# EAGLE design PCB Class (EAGLE 8.7.1)
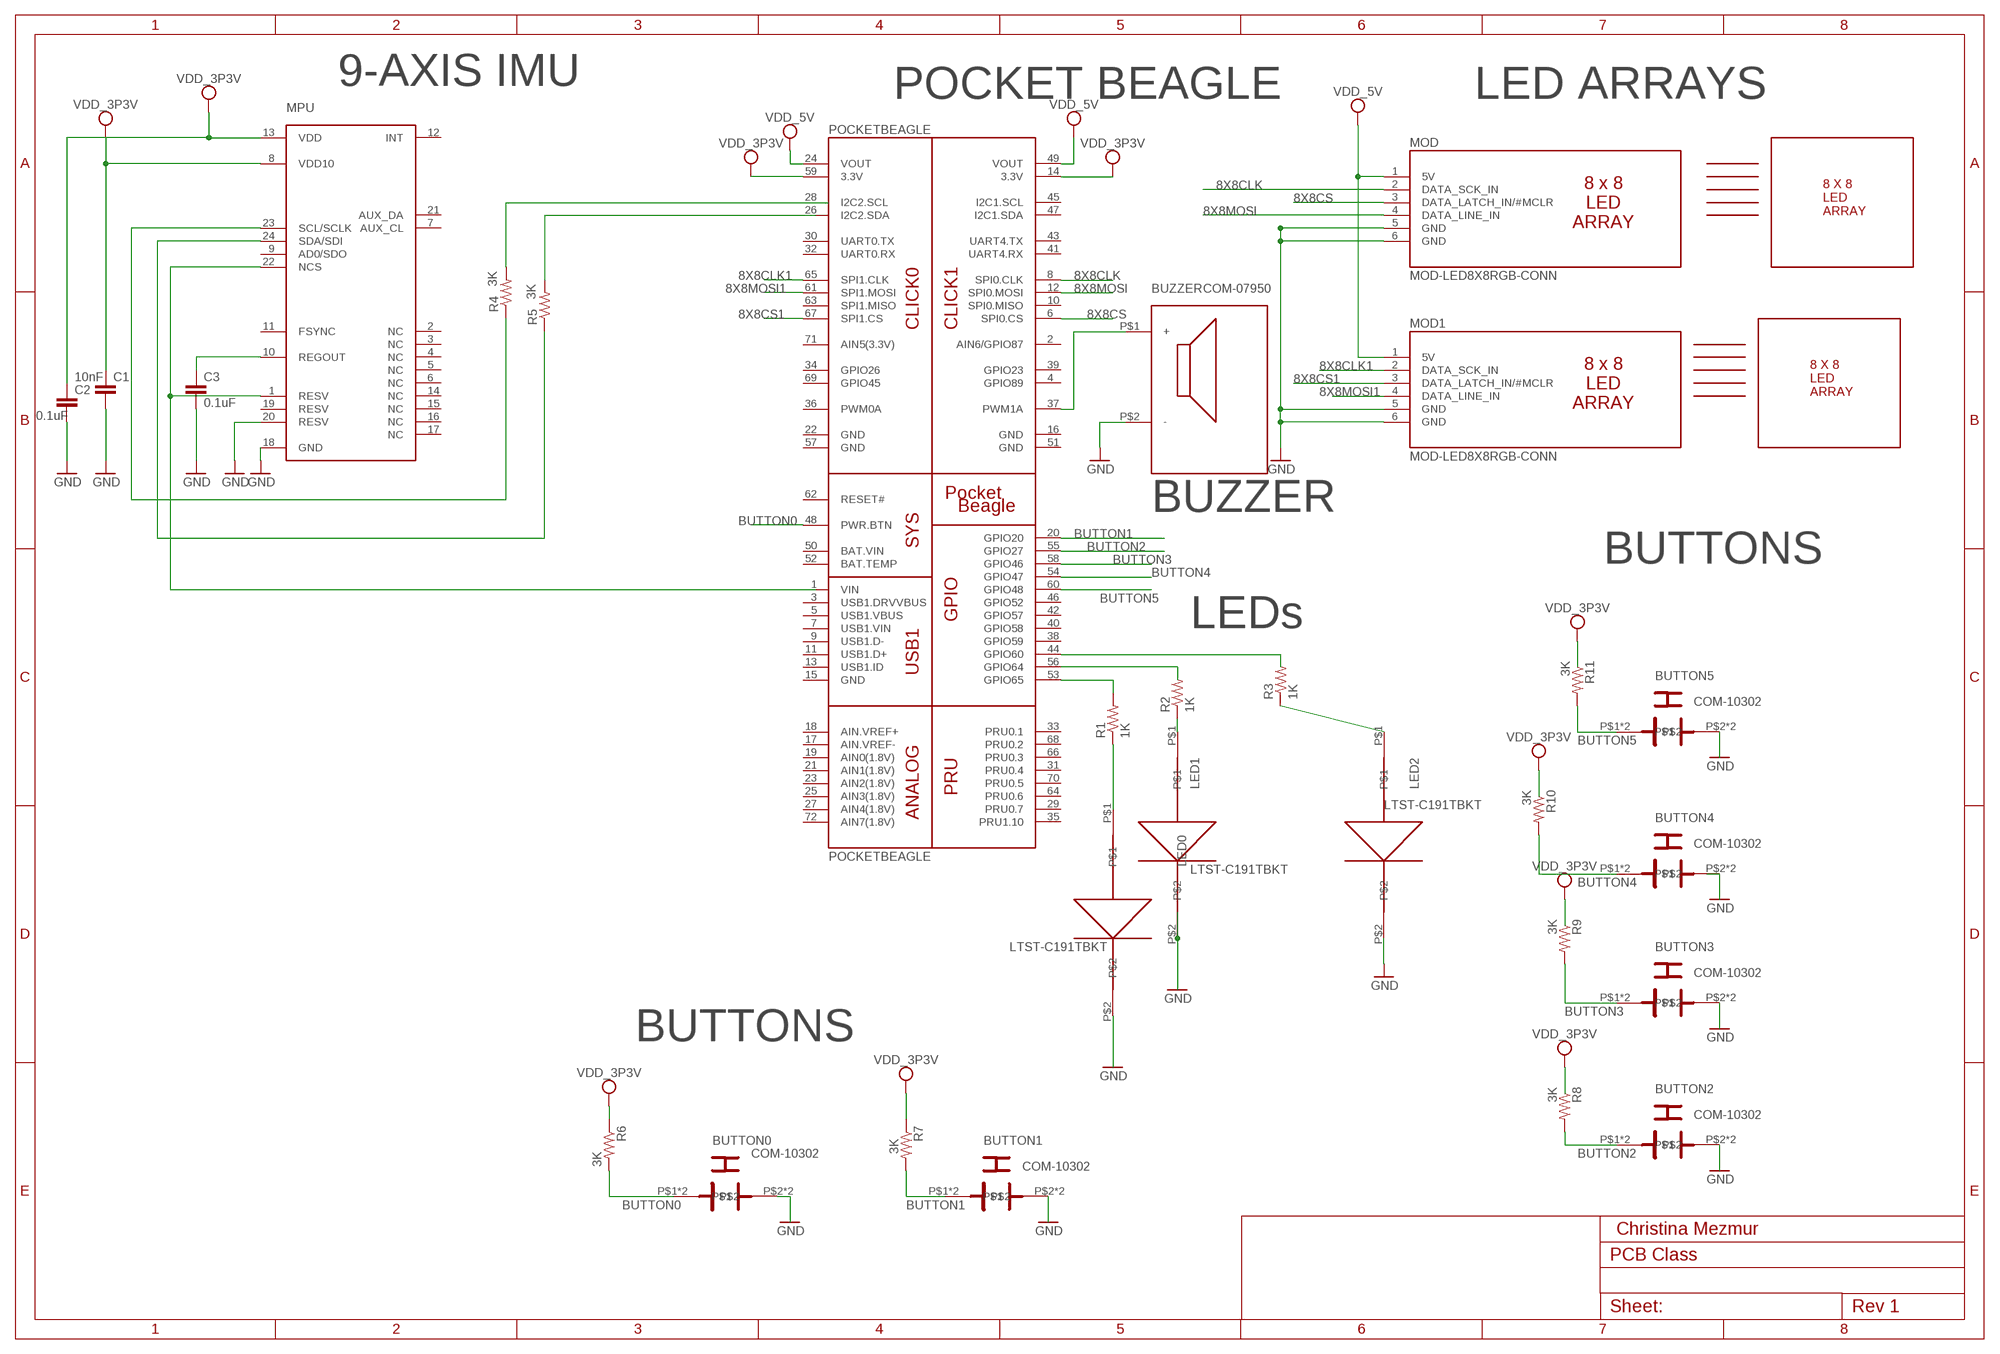
[diagram p0: schematic, sheet 1]

## Parts
BUTTON0  BUTTON  [BUTTON]
BUTTON1  BUTTON  [BUTTON]
BUTTON2  BUTTON  [BUTTON]
BUTTON3  BUTTON  [BUTTON]
BUTTON4  BUTTON  [BUTTON]
BUTTON5  BUTTON  [BUTTON]
BUZZER  SEM-1203(42)  [SEM-1203(42)]
C1  10nF  C_C0402  [C0402]
C2  0.1uF  C_C0402  [C0402]
C3  0.1uF  C_C0402  [C0402]
LED0  LTST-C191TBKT  [LTST-C191TBKT]
LED1  LTST-C191TBKT  [LTST-C191TBKT]
LED2  LTST-C191TBKT  [LTST-C191TBKT]
MOD  MOD-LED8X8RGB-CONN  [FE06W]
MOD1  MOD-LED8X8RGB-CONN  [FE06W]
MPU  MPU-9250  [QFN-3MMX3MM]
POCKETBEAGLE  POCKETBEAGLE  [POCKETBEAGLE]
R1  1K  R_R0603  [R0603]
R2  1K  R_R0603  [R0603]
R3  1K  R_R0603  [R0603]
R4  3K  R_R0603  [R0603]
R5  3K  R_R0603  [R0603]
R6  3K  R_R0603  [R0603]
R7  3K  R_R0603  [R0603]
R8  3K  R_R0603  [R0603]
R9  3K  R_R0603  [R0603]
R10  3K  R_R0603  [R0603]
R11  3K  R_R0603  [R0603]

## Nets
8X8CLK: MOD.2(DATA_SCK_IN) POCKETBEAGLE.8(SPI0.CLK)
8X8CLK1: MOD1.2(DATA_SCK_IN) POCKETBEAGLE.65(SPI1.CLK)
8X8CS: MOD.3(DATA_LATCH_IN/#MCLR) POCKETBEAGLE.6(SPI0.CS)
8X8CS1: MOD1.3(DATA_LATCH_IN/#MCLR) POCKETBEAGLE.67(SPI1.CS)
8X8MOSI: MOD.4(DATA_LINE_IN) POCKETBEAGLE.12(SPI0.MOSI)
8X8MOSI1: MOD1.4(DATA_LINE_IN) POCKETBEAGLE.61(SPI1.MOSI)
BUTTON0: BUTTON0.P$1 BUTTON0.P$3 POCKETBEAGLE.48(PWR.BTN) R6.2
BUTTON1: BUTTON1.P$1 BUTTON1.P$3 POCKETBEAGLE.20(GPIO20) R7.2
BUTTON2: BUTTON2.P$1 BUTTON2.P$3 POCKETBEAGLE.55(GPIO27) R8.2
BUTTON3: BUTTON3.P$1 BUTTON3.P$3 POCKETBEAGLE.58(GPIO46) R9.2
BUTTON4: BUTTON4.P$1 BUTTON4.P$3 POCKETBEAGLE.54(GPIO47) R10.2
BUTTON5: BUTTON5.P$1 BUTTON5.P$3 POCKETBEAGLE.60(GPIO48) R11.2
GND: BUZZER.P$2(-) C1.2 C2.2 C3.2 MOD1.5(GND) MOD1.6(GND) MOD.5(GND) MOD.6(GND) MPU.18(GND) MPU.20(RESV)
N$1: C3.1 MPU.10(REGOUT)
N$2: MPU.24(SDA/SDI) R5.1
N$3: MPU.23(SCL/SCLK) R4.1
N$5: POCKETBEAGLE.56(GPIO64) R2.2
N$6: POCKETBEAGLE.44(GPIO60) R3.2
N$7: MPU.1(RESV) MPU.22(NCS)
N$8: LED0.P$2
N$9: LED1.P$2
N$10: LED2.P$2 ; supply symbol labelled GND
N$11: LED2.P$1 R3.1
N$12: LED0.P$1 R1.1
N$13: LED1.P$1 R2.1
N$14: POCKETBEAGLE.53(GPIO65) R1.2
N$15: BUZZER.P$1(+) POCKETBEAGLE.37(PWM1A)
N$16: BUTTON0.P$2 BUTTON0.P$4
N$17: R4.2
N$18: R5.2
N$19: BUTTON1.P$2 BUTTON1.P$4
N$20: BUTTON5.P$2 BUTTON5.P$4
N$22: BUTTON3.P$2 BUTTON3.P$4
N$23: BUTTON2.P$2 BUTTON2.P$4
N$25: POCKETBEAGLE.24(VOUT) ; supply symbol labelled VDD_5V
SYS_VDD1_3P3V: C1.1 C2.1 MOD1.1(5V) MOD.1(5V) MPU.8(VDD10) MPU.13(VDD) POCKETBEAGLE.14(3.3V) POCKETBEAGLE.49(VOUT) POCKETBEAGLE.59(3.3V) R6.1 R7.1 ; supply symbol labelled VDD_3P3V, VDD_5V
Unconnected: BUTTON4.P$2 BUTTON4.P$4 MPU.2(NC) MPU.3(NC) MPU.4(NC) MPU.5(NC) MPU.6(NC) MPU.7(AUX_CL) MPU.9(AD0/SDO) MPU.11(FSYNC) MPU.12(INT) MPU.14(NC) MPU.15(NC) MPU.16(NC) MPU.17(NC) MPU.19(RESV) MPU.21(AUX_DA) POCKETBEAGLE.1(VIN) POCKETBEAGLE.2(AIN6/GPIO87) POCKETBEAGLE.3(USB1.DRVVBUS) POCKETBEAGLE.4(GPIO89) POCKETBEAGLE.5(USB1.VBUS) POCKETBEAGLE.7(USB1.VIN) POCKETBEAGLE.9(USB1.D-) POCKETBEAGLE.10(SPI0.MISO) POCKETBEAGLE.11(USB1.D+) POCKETBEAGLE.13(USB1.ID) POCKETBEAGLE.15(GND) POCKETBEAGLE.16(GND) POCKETBEAGLE.17(AIN.VREF-) POCKETBEAGLE.18(AIN.VREF+) POCKETBEAGLE.19(AIN0(1.8V)) POCKETBEAGLE.21(AIN1(1.8V)) POCKETBEAGLE.22(GND) POCKETBEAGLE.23(AIN2(1.8V)) POCKETBEAGLE.25(AIN3(1.8V)) POCKETBEAGLE.26(I2C2.SDA) POCKETBEAGLE.27(AIN4(1.8V)) POCKETBEAGLE.28(I2C2.SCL) POCKETBEAGLE.29(PRU0.7) POCKETBEAGLE.30(UART0.TX) POCKETBEAGLE.31(PRU0.4) POCKETBEAGLE.32(UART0.RX) POCKETBEAGLE.33(PRU0.1) POCKETBEAGLE.34(GPIO26) POCKETBEAGLE.35(PRU1.10) POCKETBEAGLE.36(PWM0A) POCKETBEAGLE.38(GPIO59) POCKETBEAGLE.39(GPIO23) POCKETBEAGLE.40(GPIO58) POCKETBEAGLE.41(UART4.RX) POCKETBEAGLE.42(GPIO57) POCKETBEAGLE.43(UART4.TX) POCKETBEAGLE.45(I2C1.SCL) POCKETBEAGLE.46(GPIO52) POCKETBEAGLE.47(I2C1.SDA) POCKETBEAGLE.50(BAT.VIN) POCKETBEAGLE.51(GND) POCKETBEAGLE.52(BAT.TEMP) POCKETBEAGLE.57(GND) POCKETBEAGLE.62(RESET#) POCKETBEAGLE.63(SPI1.MISO) POCKETBEAGLE.64(PRU0.6) POCKETBEAGLE.66(PRU0.3) POCKETBEAGLE.68(PRU0.2) POCKETBEAGLE.69(GPIO45) POCKETBEAGLE.70(PRU0.5) POCKETBEAGLE.71(AIN5(3.3V)) POCKETBEAGLE.72(AIN7(1.8V)) R8.1 R9.1 R10.1 R11.1

## Notes on the sheet
- 9-AXIS IMU | POCKET BEAGLE | LED ARRAYS
- 8 X 8
  LED
  ARRAY
- COM-07950
- 8 X 8
  LED
  ARRAY
- BUZZER
- BUTTONS
- LEDs
- COM-10302
- LTST-C191TBKT
- COM-10302
- LTST-C191TBKT
- LTST-C191TBKT
- COM-10302
- BUTTONS
- COM-10302
- COM-10302
- COM-10302
- Christina Mezmur

## Library data of the parts
BUTTON0 BUTTON1-BUTTON5 = ENGI301_PCB_design_project:BUTTON
BUZZER = ENGI301_PCB_design_project:SEM-1203(42)
C1-C3 = ENGI301_PCB_design_project:C_: Capacitor SMD. Sizes: 0402, 0603 & 0805
LED0 LED1 LED2 = ENGI301_PCB_design_project:LTST-C191TBKT
MOD MOD1 = ENGI301_PCB_design_project:MOD-LED8X8RGB-CONN
MPU = ENGI301_PCB_design_project:MPU-9250
POCKETBEAGLE = ENGI301_PCB_design_project:POCKETBEAGLE
R1-R11 = ENGI301_PCB_design_project:R_: RESISTOR, American symbol

## Board
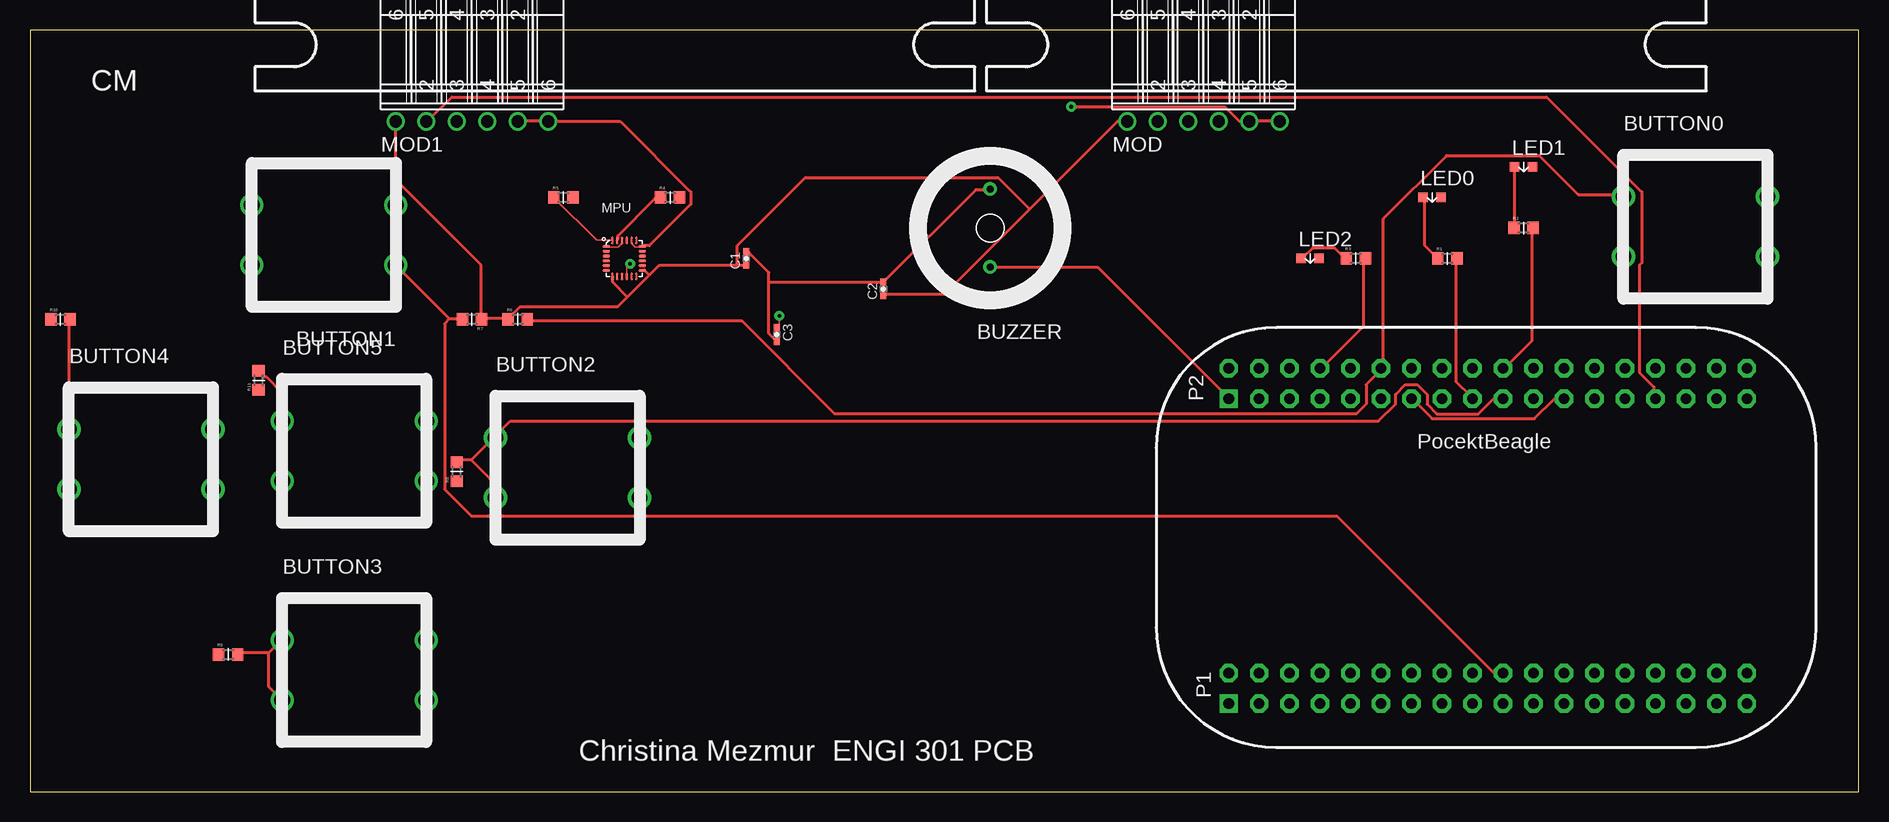
[diagram p1: board, top side]
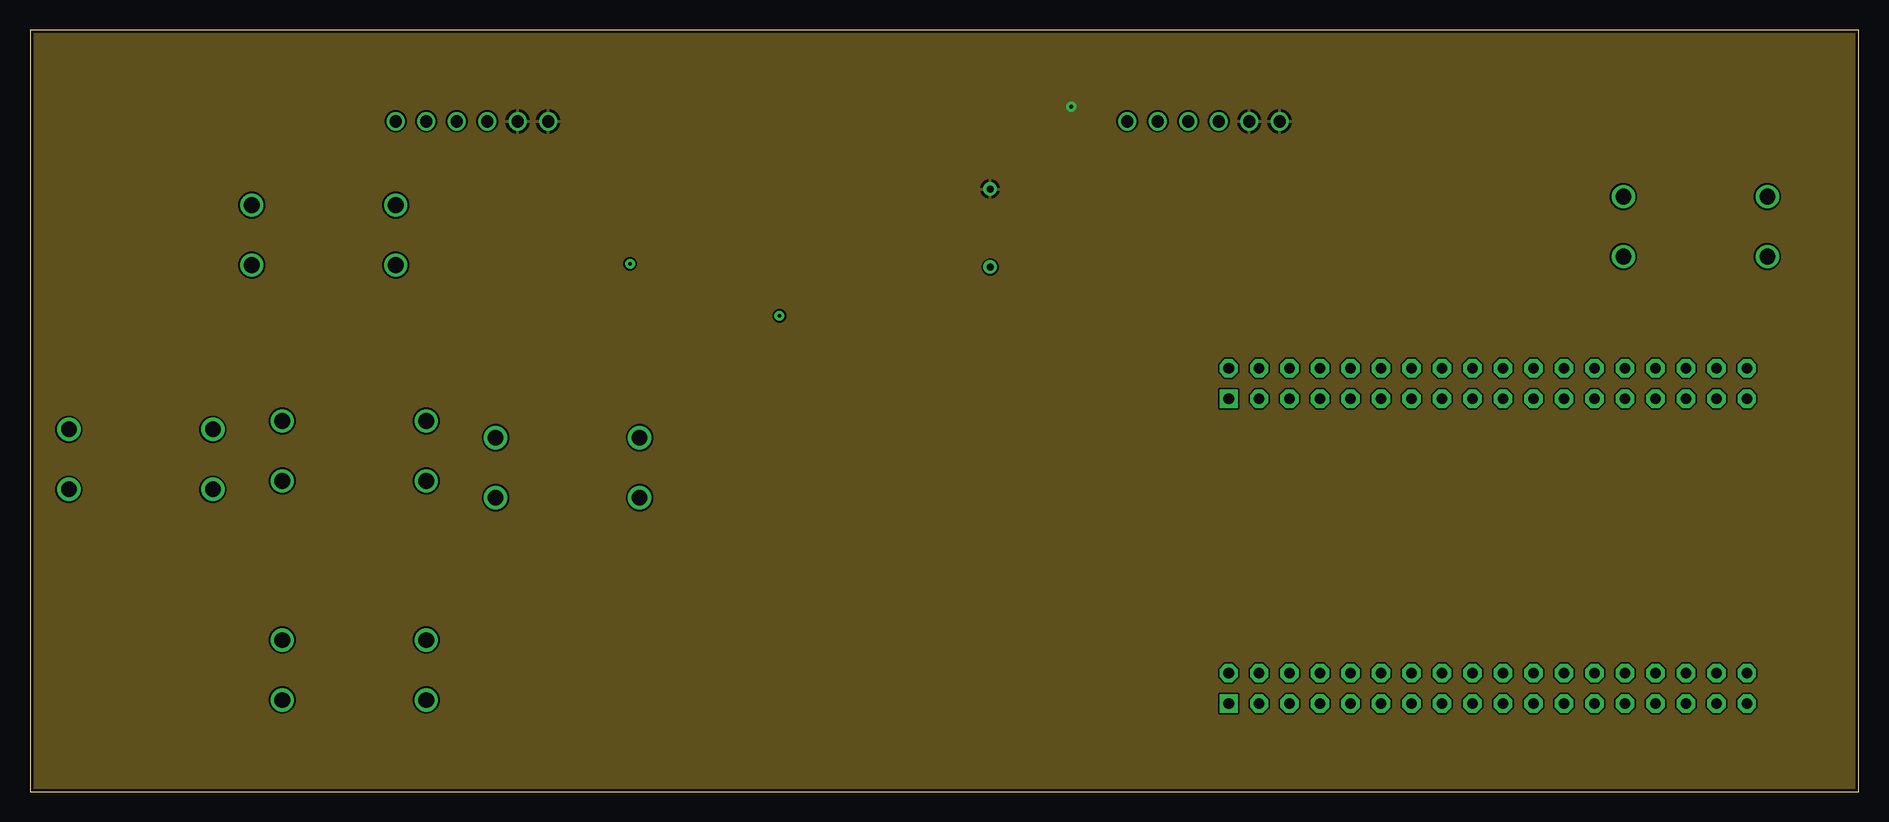
[diagram p2: board, inner layer Route2]
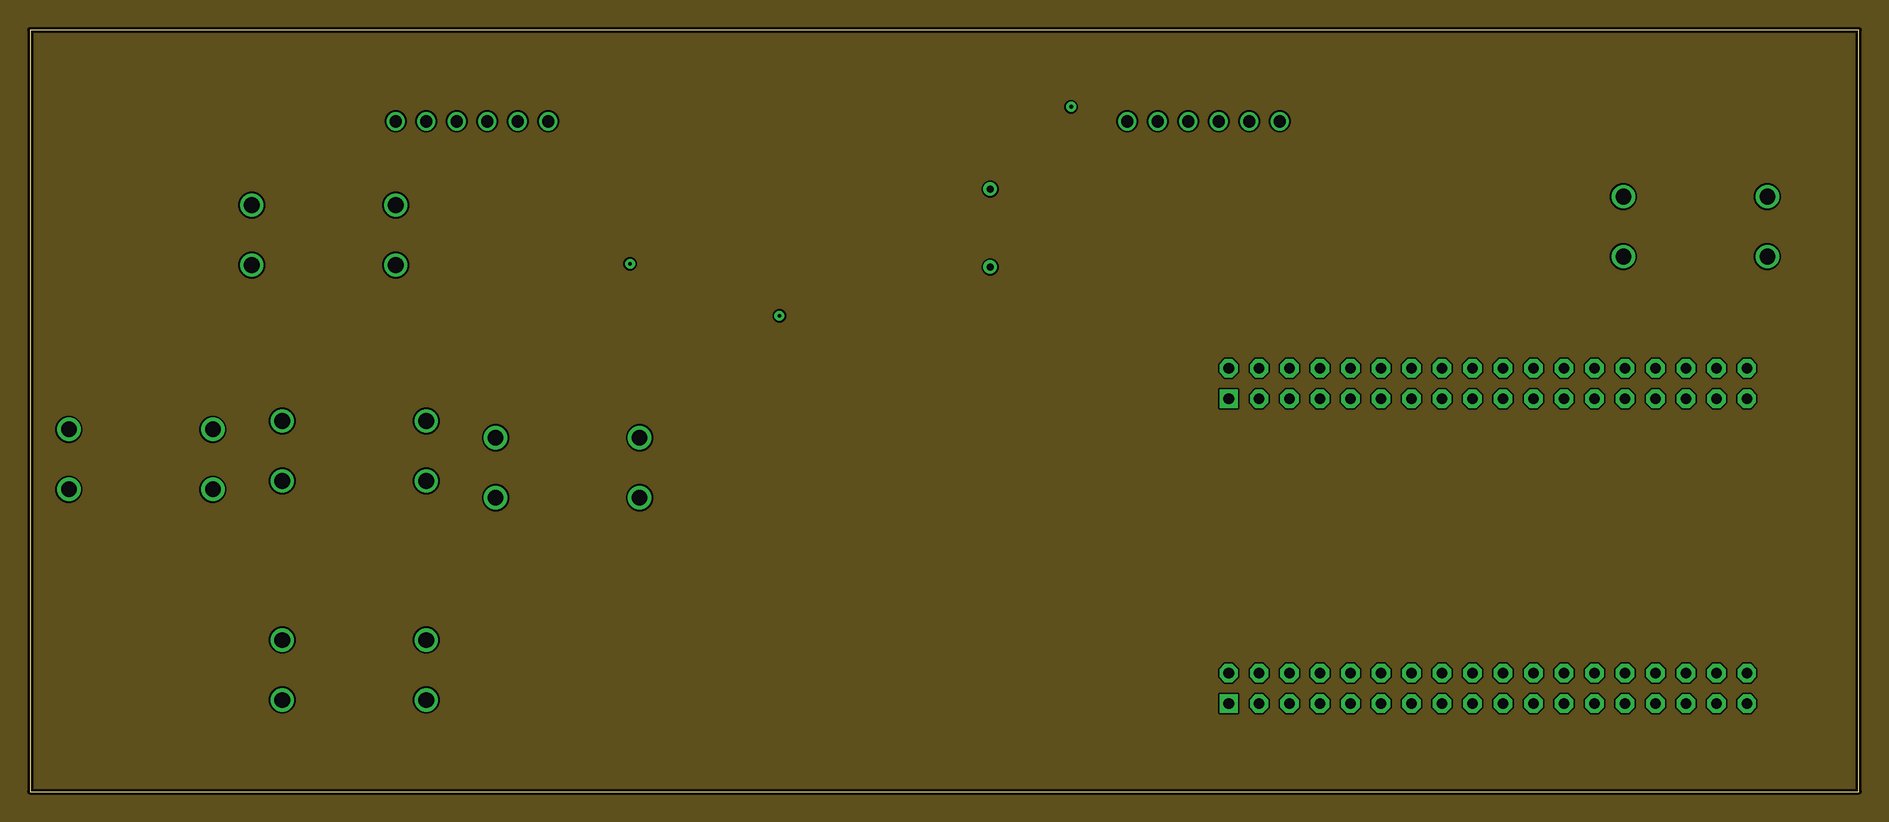
[diagram p3: board, inner layer Route15]
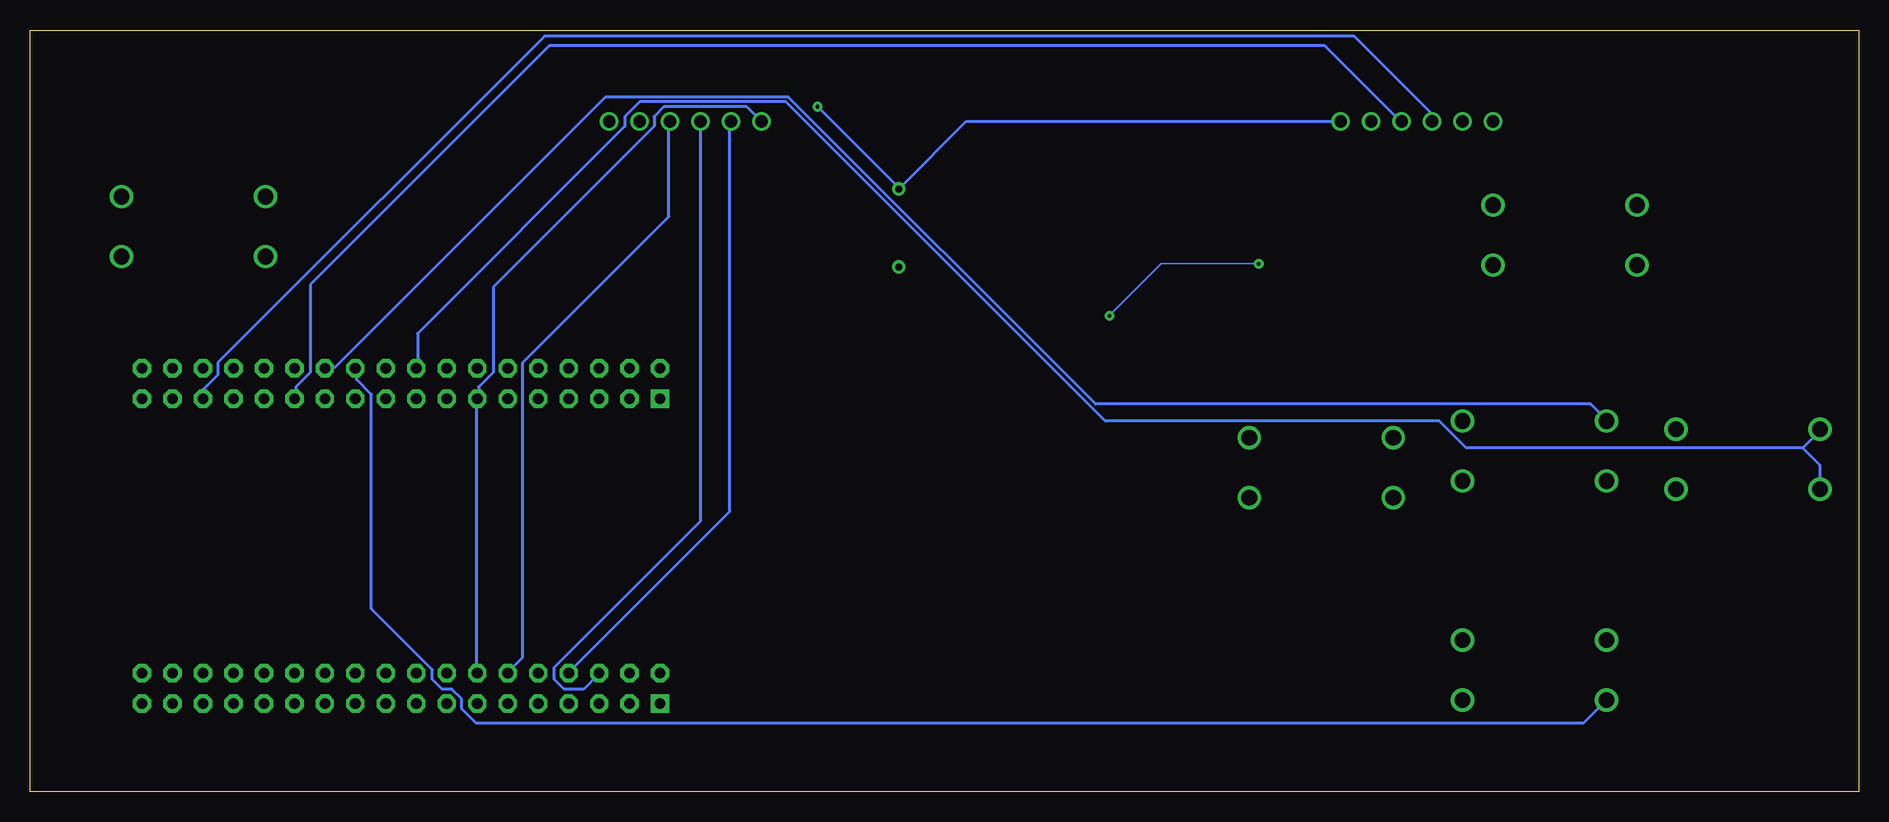
[diagram p4: board, bottom side, seen from below]

Size 152.4 x 63.5 mm. Coordinates in mm from the lower left corner, seen from the top.
Outline: 0,0 152.4,0 152.4,63.5 0,63.5 0,0
Copper layers (1*2*15*16): Top 0.035mm / dielectric 0.23mm / Route2 0.035mm / dielectric 0.93mm / Route15 0.035mm / dielectric 0.23mm / Bottom 0.035mm
Design rules "ENGI301_Maze_Project_4lyr (1) *": minimum track width 5mil, minimum drill 12mil, track to track 6mil, track to pad 5mil, pad to pad 5mil, via to via 10mil, smd to smd 10mil, copper to edge 10mil, drill to drill 12mil, minimum pad ring 10mil, minimum via ring 10mil, stop-mask expansion 3mil, vias tented up to drill 25mil, thermal gap 10mil

### Footprints (pad centres in the part's own frame; a part is rotated, then mirrored left to right if it is on the bottom)
BUTTON = drill 1.3: P$1 -6,2.5; P$2 6,2.5; P$3 -6,-2.5; P$4 6,-2.5
SEM-1203(42) = drill 0.6: P$1 0,3.25; P$2 0,-3.25
C0402 = smd 0.61 x 0.508: 1 -0.559,0; 2 0.559,0
LTST-C191TBKT = smd 0.8 x 0.8: P$1 -0.75,0; P$2 0.75,0
FE06W = drill 1.016: 1 -6.35,0; 2 -3.81,0; 3 -1.27,0; 4 1.27,0; 5 3.81,0; 6 6.35,0
QFN-3MMX3MM = smd 0.6 x 0.2: 1 -1.5,1; 2 -1.5,0.6; 3 -1.5,0.2; 4 -1.5,-0.2; 5 -1.5,-0.6; 6 -1.5,-1; 13 1.5,-1; 14 1.5,-0.6; 15 1.5,-0.2; 16 1.5,0.2; 17 1.5,0.6; 18 1.5,1 | smd 0.2 x 0.6: 7 -0.6,-1.5; 8 -1,-1.5; 9 -0.2,-1.5; 10 0.2,-1.5; 11 0.6,-1.5; 12 1,-1.5; 19 1,1.5; 20 0.6,1.5; 21 0.2,1.5; 22 -0.2,1.5; 23 -0.6,1.5; 24 -1,1.5
POCKETBEAGLE = drill 0.889 pad 1.524 square: 1 5.91,3.53; 37 5.91,28.93 | drill 0.889 pad 1.524 octagon: 2 5.91,6.07; 3 8.45,3.53; 4 8.45,6.07; 5 10.99,3.53; 6 10.99,6.07; 7 13.53,3.53; 8 13.53,6.07; 9 16.07,3.53; 10 16.07,6.07; 11 18.61,3.53; 12 18.61,6.07; 13 21.15,3.53; 14 21.15,6.07; 15 23.69,3.53; 16 23.69,6.07; 17 26.23,3.53; 18 26.23,6.07; 19 28.77,3.53; 20 28.77,6.07; 21 31.31,3.53; 22 31.31,6.07; 23 33.85,3.53; 24 33.85,6.07; 25 36.39,3.53; 26 36.39,6.07; 27 38.93,3.53; 28 38.93,6.07; 29 41.47,3.53; 30 41.47,6.07; 31 44.01,3.53; 32 44.01,6.07; 33 46.55,3.53; 34 46.55,6.07; 35 49.09,3.53; 36 49.09,6.07; 38 5.91,31.47; 39 8.45,28.93; 40 8.45,31.47; 41 10.99,28.93; 42 10.99,31.47; 43 13.53,28.93; 44 13.53,31.47; 45 16.07,28.93; 46 16.07,31.47; 47 18.61,28.93; 48 18.61,31.47; 49 21.15,28.93; 50 21.15,31.47; 51 23.69,28.93; 52 23.69,31.47; 53 26.23,28.93; 54 26.23,31.47; 55 28.77,28.93; 56 28.77,31.47; 57 31.31,28.93; 58 31.31,31.47; 59 33.85,28.93; 60 33.85,31.47; 61 36.39,28.93; 62 36.39,31.47; 63 38.93,28.93; 64 38.93,31.47; 65 41.47,28.93; 66 41.47,31.47; 67 44.01,28.93; 68 44.01,31.47; 69 46.55,28.93; 70 46.55,31.47; 71 49.09,28.93; 72 49.09,31.47
R0603 = smd 0.95 x 1.031: 1 -0.8,0; 2 0.8,0

### Placement (x,y rotation side)
BUTTON0  138.78,47.1 0 top
BUTTON1  24.48,46.4 180 top
BUTTON2  44.8,27 0 top
BUTTON3  27.02,10.14 0 top
BUTTON4  9.24,27.7 0 top
BUTTON5  27.02,28.4 0 top
BUZZER  80.01,46.99 180 top
C1  59.69,44.45 90 top
C2  71.12,41.91 90 top
C3  62.23,38.1 270 top
LED0  116.84,49.53 0 top
LED1  124.46,52.07 0 top
LED2  106.68,44.45 0 top
MOD  97.79,55.88 0 top
MOD1  36.83,55.88 0 top
MPU  49.53,44.45 0 top
POCKETBEAGLE  93.98,3.81 0 top
R1  118.11,44.45 0 top
R2  124.46,46.99 0 top
R3  110.49,44.45 0 top
R4  53.34,49.53 0 top
R5  44.45,49.53 0 top
R6  40.64,39.37 0 top
R7  36.83,39.37 180 top
R8  35.56,26.67 90 top
R9  16.51,11.43 0 top
R10  2.54,39.37 0 top
R11  19.05,34.29 90 top
U$1  [MOD-LED8X8RGB]  78.74,58.42 90 top
U$2  [MOD-LED8X8RGB]  139.7,58.42 90 top
U$3  [MOD-LED8X8RGB]  78.74,116.84 90 top  (outside the outline)
U$4  [MOD-LED8X8RGB]  139.7,116.84 90 top  (outside the outline)

### Tracks (layer width: path | path; a pad name or v marks a point on that pad's centre or on a via)
8X8CLK
  Bottom 0.254: MOD.2 94.08,55.88 94.08,23.37 107.49,9.96 POCKETBEAGLE.8
8X8CLK1
  Top 0.254: POCKETBEAGLE.65 135.33,32.92 135.33,33.73 134.11,34.95 134.11,43.89 134.31,44.09 134.31,49.99 126.39,57.91 35.15,57.91 33.12,55.88 MOD1.2
8X8CS
  Bottom 0.254: MOD.3 96.52,22.55 108.71,10.36 108.71,9.35 107.9,8.53 106.27,8.53 105.05,9.75 POCKETBEAGLE.6
8X8CS1
  Bottom 0.254: MOD1.3 35.56,56.49 42.06,62.99 109.53,62.99 136.75,35.76 136.75,34.75 137.97,33.53 137.97,32.92 POCKETBEAGLE.67
8X8MOSI
  Bottom 0.254: MOD.4 99.16,55.88 99.16,47.95 111.35,35.76 111.35,11.18 112.57,9.96 POCKETBEAGLE.12
8X8MOSI1
  Bottom 0.254: POCKETBEAGLE.61 130.25,32.92 130.25,33.73 129.03,34.95 129.03,42.27 109.12,62.18 44.5,62.18 38.2,55.88 MOD1.4
BUTTON0
  Top 0.254: BUTTON0.P$3 132.89,44.7 132.89,49.58 BUTTON0.P$1 132.69,49.78 129.03,49.78 125.78,53.03 118.06,53.03 112.78,47.75 112.78,35.36 POCKETBEAGLE.48 112.57,35.15 111.35,33.93 111.35,32.31 110.54,31.5 67.06,31.5 59.33,39.22 41.45,39.22 R6.2
BUTTON1
  Top 0.254: 34.95,39.42 35.97,39.42 R7.2 | 34.95,39.42 BUTTON1.P$1 BUTTON1.P$3 | 34.95,39.42 34.54,39.01 34.54,25.2 36.78,22.96 108.92,22.96 121.92,9.96 122.73,9.96 POCKETBEAGLE.20
BUTTON2
  Top 0.254: 36.78,27.64 35.56,27.64 R8.2 | 36.78,27.64 38.61,29.46 BUTTON2.P$1 38.81,29.67 40.03,30.89 112.37,30.89 113.79,32.31 113.79,33.12 114.61,33.93 115.62,33.93 116.43,33.12 116.43,32.31 117.25,31.5 120.7,31.5 121.92,32.72 122.73,32.72 POCKETBEAGLE.55 | 36.78,27.64 38.61,25.81 38.61,24.59 BUTTON2.P$3
BUTTON3
  Top 0.254: 19.91,11.58 17.48,11.58 R9.2 | 19.91,11.58 20.93,12.6 BUTTON3.P$1 | 19.91,11.58 19.91,8.74 20.93,7.72 BUTTON3.P$3
  Bottom 0.254: POCKETBEAGLE.58 125.17,35.15 125.17,34.34 123.95,33.12 123.95,15.24 118.87,10.16 118.87,9.35 118.06,8.53 117.25,8.53 116.43,7.72 116.43,6.91 115.21,5.69 22.96,5.69 21.13,7.52 BUTTON3.P$3
BUTTON4
  Top 0.254: R10.2 3.25,39.22 3.25,30.28 BUTTON4.P$1
  Bottom 0.254: 4.67,28.65 32.72,28.65 34.95,30.89 62.79,30.89 89.41,57.51 101.6,57.51 102.82,56.29 102.82,55.47 120.09,38.2 120.09,35.36 POCKETBEAGLE.54 | 4.67,28.65 3.25,30.07 BUTTON4.P$1 | 4.67,28.65 3.25,27.23 3.25,25.4 BUTTON4.P$3
BUTTON5
  Top 0.254: R11.2 19.1,34.95 19.51,34.54 19.71,34.54 20.93,33.33 20.93,31.09 BUTTON5.P$1 21.13,30.89 21.13,26.01 BUTTON5.P$3
  Bottom 0.254: POCKETBEAGLE.60 127.81,35.36 127,35.36 104.44,57.91 89.2,57.91 63.6,32.31 22.35,32.31 21.13,31.09 BUTTON5.P$1
GND  (via drill 0.3)
  Top 0.127: MPU.20 50.15,45.82 50.15,45.68 50.43,45.4 50.99,45.4 MPU.18
  Top 0.254: MOD.6 MOD.5 100.79,55.88 99.57,57.1 v86.77,57.1 | MOD1.5 MOD1.6 49.17,55.88 55.07,49.99 55.07,48.97 51.61,45.52 51.21,45.52 MPU.18 | 61.57,42.47 61.57,38.2 C3.2 | 61.57,42.47 61.57,43.28 59.94,44.91 59.74,44.91 C1.2 | 61.57,42.47 C2.2 78.84,50.19 79.86,50.19 BUZZER.P$2
  Bottom 0.254: MOD1.6 74.37,55.88 79.86,50.39 BUZZER.P$2 80.06,50.39 v86.77,57.1
  pour Route2: -12.7,-12.7 -12.7,76.2 165.1,76.2 165.1,-12.7
N$1  (via drill 0.3)
  Top 0.127: v50.01,44.01 49.73,43.73 49.73,43.03 MPU.10 | v62.45,39.67 62.45,38.84 62.31,38.7 C3.1
  Bottom 0.127: v50.01,44.01 58.12,44.01 v62.45,39.67
N$2
  Top 0.127: R5.1 47.22,45.96 48.48,45.96 MPU.24
N$3
  Top 0.254: MPU.23 48.97,46.13 48.97,46.33 52.02,49.38 52.43,49.38 R4.1
N$5
  Top 0.254: R2.2 125.17,46.94 125.17,37.59 122.94,35.36 POCKETBEAGLE.56
N$6
  Top 0.254: R3.2 111.15,44.3 111.15,38.81 107.7,35.36 POCKETBEAGLE.44
N$7
  Top 0.127: MPU.1 48.06,45.4 49.03,45.4 49.31,45.68 49.31,45.82 MPU.22
N$11
  Top 0.254: LED2.P$1 106.07,44.5 106.88,45.31 108.71,45.31 109.53,44.5 R3.1
N$12
  Top 0.254: LED0.P$1 116.23,49.38 116.23,45.52 117.25,44.5 R1.1
N$13
  Top 0.254: LED1.P$1 123.75,52.02 123.75,47.14 R2.1
N$14
  Top 0.254: R1.2 118.87,44.3 118.87,34.14 120.09,32.92 POCKETBEAGLE.53
N$15
  Top 0.254: BUZZER.P$1 80.06,43.69 89,43.69 99.77,32.92 POCKETBEAGLE.37
N$16
  Top 0.254: BUTTON0.P$4 144.88,44.7 144.88,49.58 BUTTON0.P$2
N$19
  Top 0.254: BUTTON1.P$2 18.49,44.09 18.49,48.77 BUTTON1.P$4
N$20
  Top 0.254: BUTTON5.P$4 33.12,26.01 33.12,30.89 BUTTON5.P$2
N$22
  Top 0.254: BUTTON3.P$4 33.12,7.72 33.12,12.6 BUTTON3.P$2
N$23
  Top 0.254: BUTTON2.P$2 BUTTON2.P$4
SYS_VDD1_3P3V
  Top 0.254: POCKETBEAGLE.59 127.81,32.72 127,32.72 125.37,31.09 116.84,31.09 115.21,32.72 POCKETBEAGLE.49 | 83.31,48.56 90.63,55.88 MOD.1 | 83.31,48.56 76.2,41.45 71.12,41.45 C2.1 | 58.93,43.89 52.43,43.89 51.61,43.08 | 58.93,43.89 C1.1 | 49.78,41.25 48.97,40.44 40.84,40.44 39.83,39.42 | 49.78,41.25 51.61,43.08 | 39.83,39.42 37.8,39.42 R7.1 37.59,39.42 37.59,43.89 30.48,51 MOD1.1 | 39.83,39.42 R6.1 | 83.31,48.56 80.67,51.21 64.62,51.21 58.93,45.52 58.93,43.89 | 49.78,41.25 48.56,42.47 48.56,42.88 MPU.8 | 51.61,43.08 51.21,43.48 MPU.13
  Bottom 0.254: POCKETBEAGLE.14 115.21,9.96 115.21,32.72 POCKETBEAGLE.49 115.01,32.92 115.01,33.73 113.79,34.95 113.79,42.06 100.38,55.47 100.38,56.29 99.57,57.1 92.66,57.1 MOD.1
VDD_3P3V
  pour Route15: -25.4,-25.4 -25.4,88.9 177.8,88.9 177.8,-25.4

### Text on the board
tSilk: CM | Christina Mezmur ENGI 301 PCB